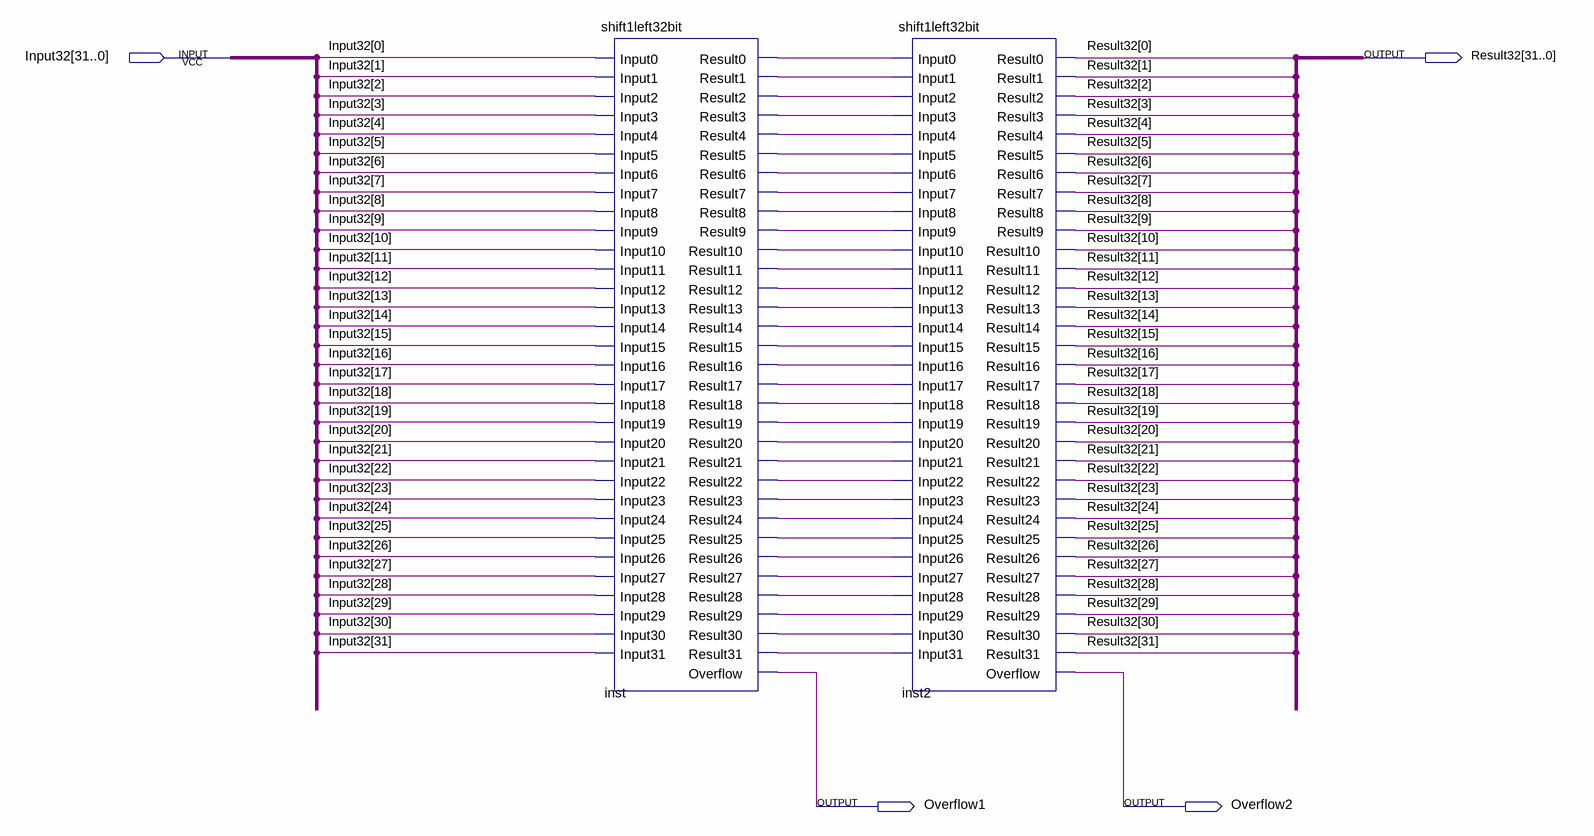
[diagram p0: schematic sheet]
// Quartus schematic shift2left32bit.bdf as structural Verilog: 2 symbols, 4 pins
module shift2left32bit (
  input  [31:0] Input32,
  output [31:0] Result32,
  output Overflow1,
  output Overflow2
);

  wire inst_result0, inst_result1, inst_result2, inst_result3, inst_result4, inst_result5, inst_result6,
       inst_result7, inst_result8, inst_result9, inst_result10, inst_result11, inst_result12, inst_result13,
       inst_result14, inst_result15, inst_result16, inst_result17, inst_result18, inst_result19,
       inst_result20, inst_result21, inst_result22, inst_result23, inst_result24, inst_result25,
       inst_result26, inst_result27, inst_result28, inst_result29, inst_result30, inst_result31;

  shift1left32bit inst (
    .Input0(Input32[0]), .Input1(Input32[1]), .Input2(Input32[2]), .Input3(Input32[3]), .Input4(Input32[4]),
    .Input5(Input32[5]), .Input6(Input32[6]), .Input7(Input32[7]), .Input8(Input32[8]), .Input9(Input32[9]),
    .Input10(Input32[10]), .Input11(Input32[11]), .Input12(Input32[12]), .Input13(Input32[13]),
    .Input14(Input32[14]), .Input15(Input32[15]), .Input16(Input32[16]), .Input17(Input32[17]),
    .Input18(Input32[18]), .Input19(Input32[19]), .Input20(Input32[20]), .Input21(Input32[21]),
    .Input22(Input32[22]), .Input23(Input32[23]), .Input24(Input32[24]), .Input25(Input32[25]),
    .Input26(Input32[26]), .Input27(Input32[27]), .Input28(Input32[28]), .Input29(Input32[29]),
    .Input30(Input32[30]), .Input31(Input32[31]), .Result0(inst_result0), .Result1(inst_result1),
    .Result2(inst_result2), .Result3(inst_result3), .Result4(inst_result4), .Result5(inst_result5),
    .Result6(inst_result6), .Result7(inst_result7), .Result8(inst_result8), .Result9(inst_result9),
    .Result10(inst_result10), .Result11(inst_result11), .Result12(inst_result12), .Result13(inst_result13),
    .Result14(inst_result14), .Result15(inst_result15), .Result16(inst_result16), .Result17(inst_result17),
    .Result18(inst_result18), .Result19(inst_result19), .Result20(inst_result20), .Result21(inst_result21),
    .Result22(inst_result22), .Result23(inst_result23), .Result24(inst_result24), .Result25(inst_result25),
    .Result26(inst_result26), .Result27(inst_result27), .Result28(inst_result28), .Result29(inst_result29),
    .Result30(inst_result30), .Result31(inst_result31), .Overflow(Overflow1));
  shift1left32bit inst2 (
    .Input0(inst_result0), .Input1(inst_result1), .Input2(inst_result2), .Input3(inst_result3),
    .Input4(inst_result4), .Input5(inst_result5), .Input6(inst_result6), .Input7(inst_result7),
    .Input8(inst_result8), .Input9(inst_result9), .Input10(inst_result10), .Input11(inst_result11),
    .Input12(inst_result12), .Input13(inst_result13), .Input14(inst_result14), .Input15(inst_result15),
    .Input16(inst_result16), .Input17(inst_result17), .Input18(inst_result18), .Input19(inst_result19),
    .Input20(inst_result20), .Input21(inst_result21), .Input22(inst_result22), .Input23(inst_result23),
    .Input24(inst_result24), .Input25(inst_result25), .Input26(inst_result26), .Input27(inst_result27),
    .Input28(inst_result28), .Input29(inst_result29), .Input30(inst_result30), .Input31(inst_result31),
    .Result0(Result32[0]), .Result1(Result32[1]), .Result2(Result32[2]), .Result3(Result32[3]),
    .Result4(Result32[4]), .Result5(Result32[5]), .Result6(Result32[6]), .Result7(Result32[7]),
    .Result8(Result32[8]), .Result9(Result32[9]), .Result10(Result32[10]), .Result11(Result32[11]),
    .Result12(Result32[12]), .Result13(Result32[13]), .Result14(Result32[14]), .Result15(Result32[15]),
    .Result16(Result32[16]), .Result17(Result32[17]), .Result18(Result32[18]), .Result19(Result32[19]),
    .Result20(Result32[20]), .Result21(Result32[21]), .Result22(Result32[22]), .Result23(Result32[23]),
    .Result24(Result32[24]), .Result25(Result32[25]), .Result26(Result32[26]), .Result27(Result32[27]),
    .Result28(Result32[28]), .Result29(Result32[29]), .Result30(Result32[30]), .Result31(Result32[31]),
    .Overflow(Overflow2));
endmodule
